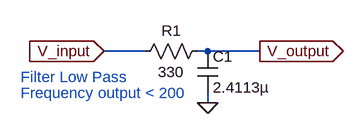
[diagram p0: schematic Low_Pass_200.asc]
Low_Pass_200.asc, the LTspice schematic file:
Version 4
SHEET 1 880 680
WIRE 16 80 -48 80
WIRE 112 80 96 80
WIRE 192 80 112 80
WIRE 112 160 112 144
FLAG -48 80 V_input
IOPIN -48 80 In
FLAG 112 160 0
FLAG 192 80 V_output
IOPIN 192 80 Out
SYMBOL res 112 64 R90
WINDOW 0 0 56 VBottom 2
WINDOW 3 32 56 VTop 2
SYMATTR InstName R1
SYMATTR Value 330
SYMBOL cap 96 80 R0
SYMATTR InstName C1
SYMATTR Value 2.4113µ
TEXT -176 120 Left 2 ;Filter Low Pass
TEXT -176 144 Left 2 ;Frequency output < 200

The netlist it stands for:
* Low_Pass_200.asc
R1 V_output V_input 330
C1 V_output 0 2.4113µ
* Filter Low Pass
* Frequency output < 200
.backanno
.end